# Altium schematic sheet CLKB_fabric_interface.SchDoc
size A3
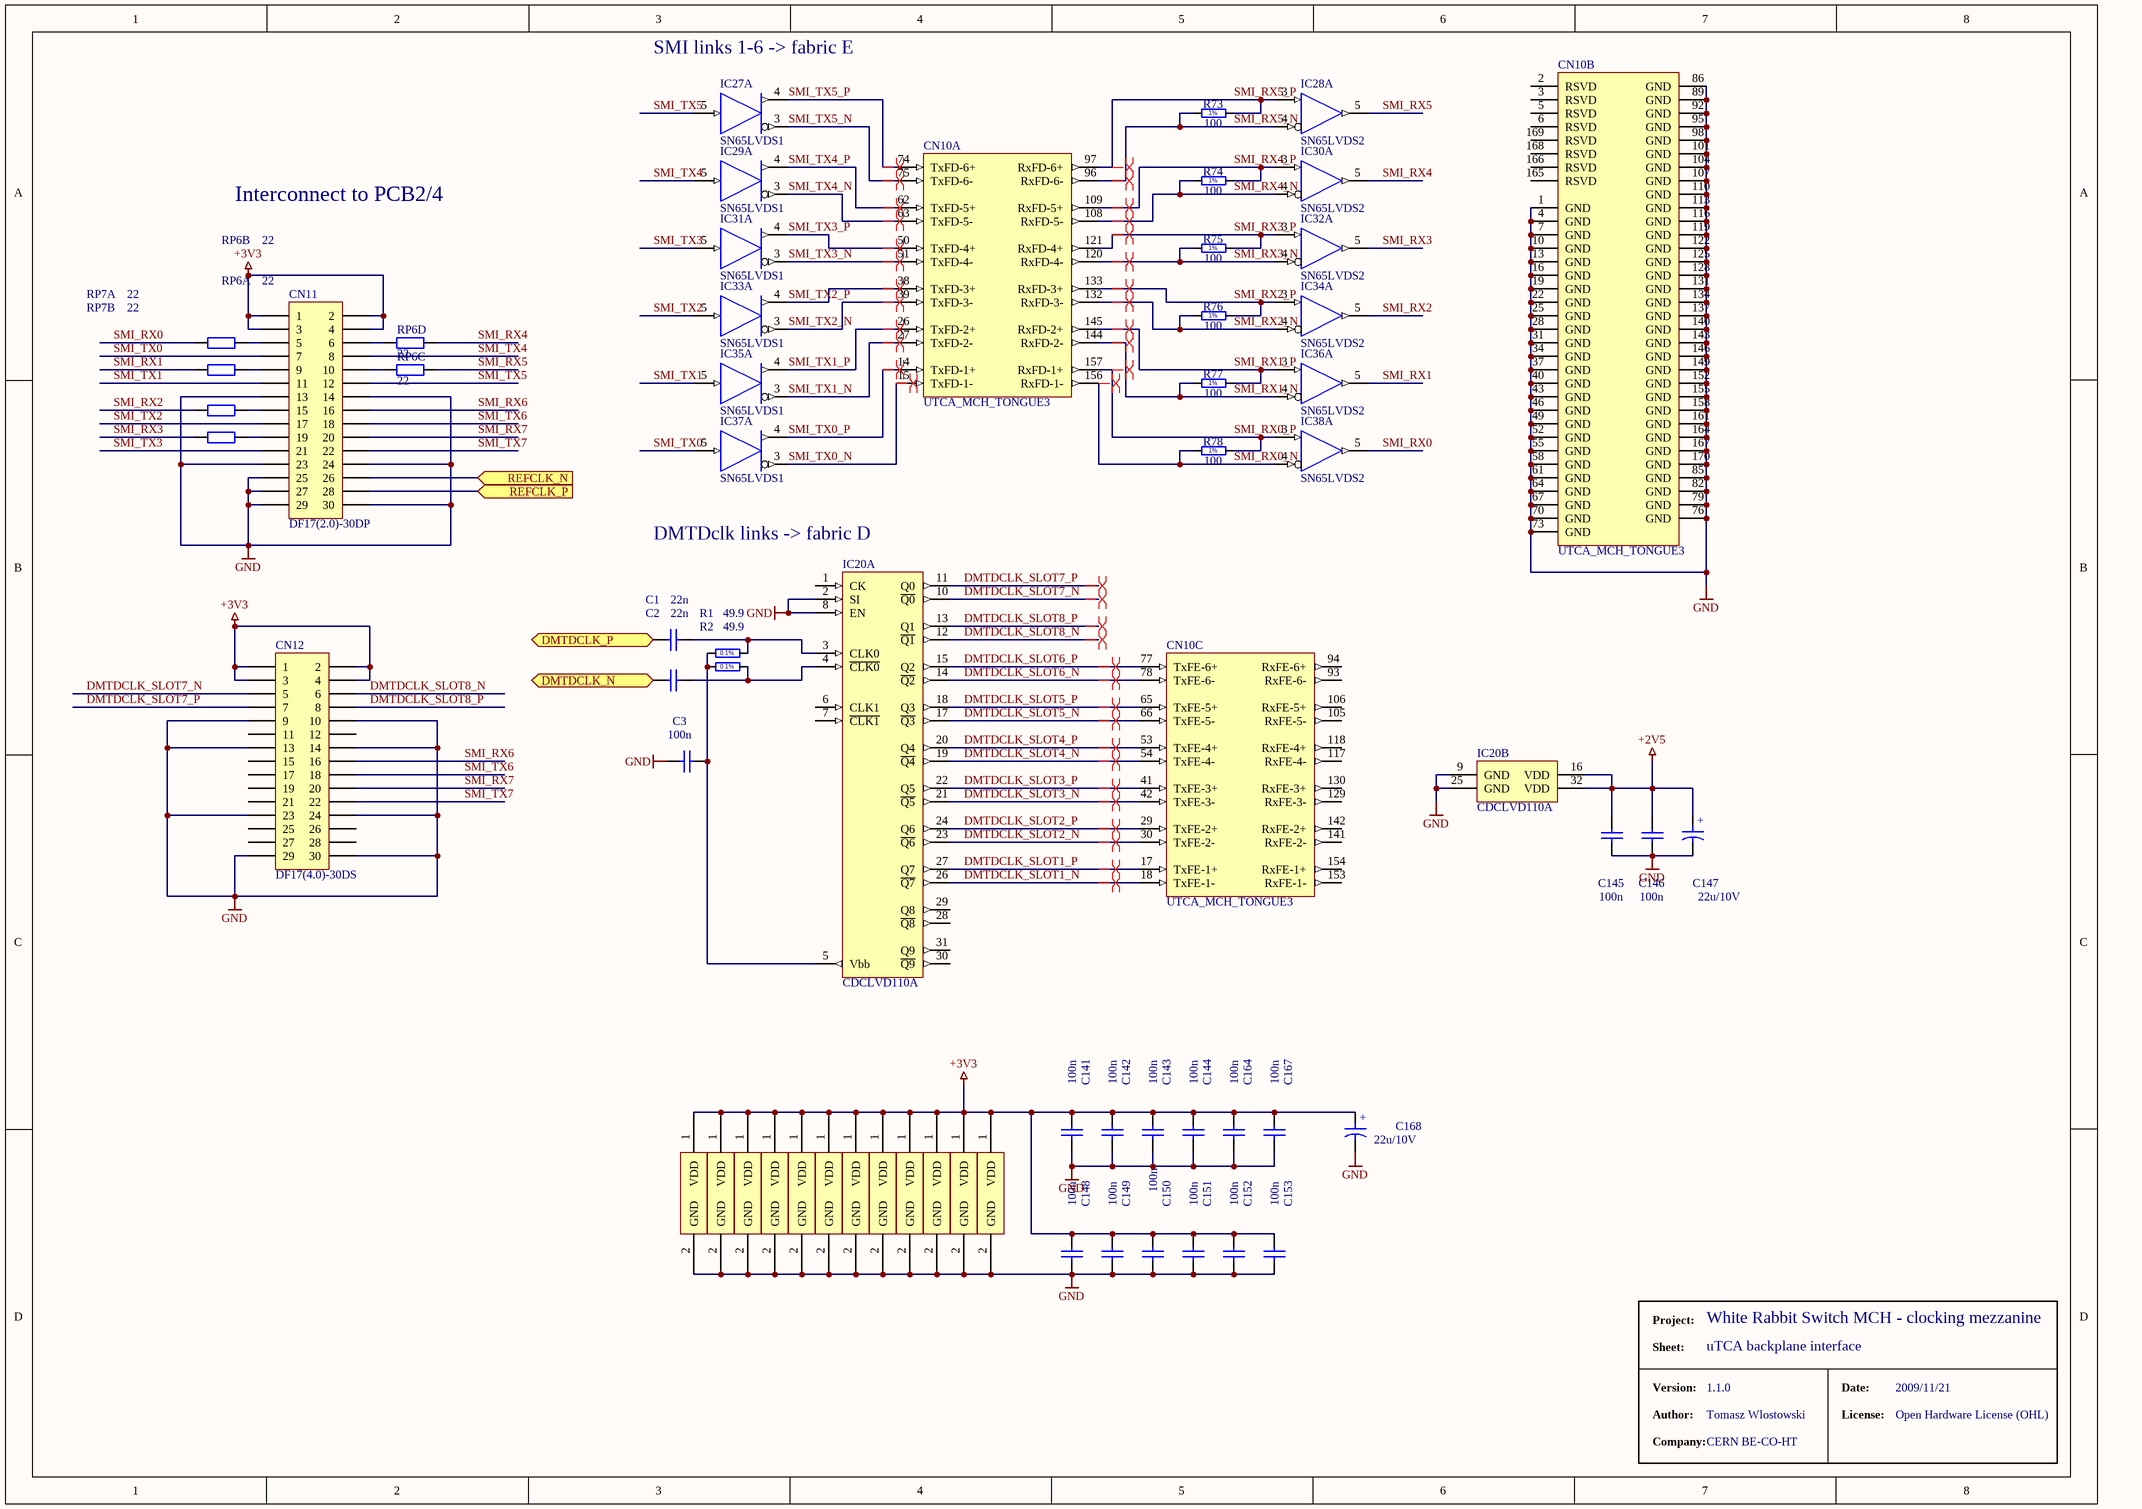
[diagram p0: CLKB_fabric_interface.SchDoc]

## Parts
C1  22n  [CAPC1005X55N]
C2  22n  [CAPC1005X55N]
C3  100n  [CAPC1608X87N]
C141  100n  [CAPC1608X87N]
C142  100n  [CAPC1608X87N]
C143  100n  [CAPC1608X87N]
C144  100n  [CAPC1608X87N]
C145  100n  [CAPC1608X87N]
C146  100n  [CAPC1608X87N]
C147  22u/10V  [CAPMP3216X180N]
C148  100n  [CAPC1608X87N]
C149  100n  [CAPC1608X87N]
C150  100n  [CAPC1608X87N]
C151  100n  [CAPC1608X87N]
C152  100n  [CAPC1608X87N]
C153  100n  [CAPC1608X87N]
C164  100n  [CAPC1608X87N]
C167  100n  [CAPC1608X87N]
C168  22u/10V  [CAPMP3216X180N]
CN10  UTCA_MCH_TONGUE3  [UTCA_MCH_TONGUE2_3_4]  (parts A,B,C of 7)
CN11  DF17(2.0)-30DP  [DF17-30-PLUG]
CN12  DF17(4.0)-30DS  [DF17-30-SOCKET]
IC20  CDCLVD110A  [QFP80P900X900-32M]  (parts A,B of 2)
IC27  SN65LVDS1  [SOT23-5AL]  (parts A,B of 2)
IC28  SN65LVDS2  [SOT23-5AL]  (parts A,B of 2)
IC29  SN65LVDS1  [SOT23-5AL]  (parts A,B of 2)
IC30  SN65LVDS2  [SOT23-5AL]  (parts A,B of 2)
IC31  SN65LVDS1  [SOT23-5AL]  (parts A,B of 2)
IC32  SN65LVDS2  [SOT23-5AL]  (parts A,B of 2)
IC33  SN65LVDS1  [SOT23-5AL]  (parts A,B of 2)
IC34  SN65LVDS2  [SOT23-5AL]  (parts A,B of 2)
IC35  SN65LVDS1  [SOT23-5AL]  (parts A,B of 2)
IC36  SN65LVDS2  [SOT23-5AL]  (parts A,B of 2)
IC37  SN65LVDS1  [SOT23-5AL]  (parts A,B of 2)
IC38  SN65LVDS2  [SOT23-5AL]  (parts A,B of 2)
R1  49.9  [RESC1608X55N]
R2  49.9  [RESC1608X55N]
R73  100  [RESC1608X55N]
R74  100  [RESC1608X55N]
R75  100  [RESC1608X55N]
R76  100  [RESC1608X55N]
R77  100  [RESC1608X55N]
R78  100  [RESC1608X55N]
RP6  value 22  [YC124]  (hidden comment: 22 0804)  (parts A,B,C,D of 4)
RP7  value 22  [YC124]  (hidden comment: 22 0804)  (parts A,B of 4)

## Ports
DMTDCLK_N (in), DMTDCLK_P (in), REFCLK_N (in), REFCLK_P (in)

## Nets
+2V5: C145.1 C146.1 C147.1 IC20.16(VDD) IC20.32(VDD)
+3V3: C141.1 C142.1 C143.1 C144.1 C148.1 C149.1 C150.1 C151.1 C152.1 C153.1 C164.1 C167.1 C168.1 CN11.1 CN11.2 CN11.3 CN11.4 CN12.1 CN12.2 CN12.3 CN12.4 IC27.1(VDD) IC28.1(VDD) IC29.1(VDD) IC30.1(VDD) IC31.1(VDD) IC32.1(VDD) IC33.1(VDD) IC34.1(VDD) IC35.1(VDD) IC36.1(VDD) IC37.1(VDD) IC38.1(VDD)
GND: C3.1 C141.2 C142.2 C143.2 C144.2 C145.2 C146.2 C147.2 C148.2 C149.2 C150.2 C151.2 C152.2 C153.2 C164.2 C167.2 C168.2 CN10.1(GND) CN10.4(GND) CN10.7(GND) CN10.10(GND) CN10.13(GND) CN10.16(GND) CN10.19(GND) CN10.22(GND) CN10.25(GND) CN10.28(GND) CN10.31(GND) CN10.34(GND) CN10.37(GND) CN10.40(GND) CN10.43(GND) CN10.46(GND) CN10.49(GND) CN10.52(GND) CN10.55(GND) CN10.58(GND) CN10.61(GND) CN10.64(GND) CN10.67(GND) CN10.70(GND) CN10.73(GND) CN10.76(GND) CN10.79(GND) CN10.82(GND) CN10.85(GND) CN10.86(GND) CN10.89(GND) CN10.92(GND) CN10.95(GND) CN10.98(GND) CN10.101(GND) CN10.104(GND) CN10.107(GND) CN10.110(GND) CN10.113(GND) CN10.116(GND) CN10.119(GND) CN10.122(GND) CN10.125(GND) CN10.128(GND) CN10.131(GND) CN10.134(GND) CN10.137(GND) CN10.140(GND) CN10.143(GND) CN10.146(GND) CN10.149(GND) CN10.152(GND) CN10.155(GND) CN10.158(GND) CN10.161(GND) CN10.164(GND) CN10.167(GND) CN10.170(GND) CN11.13 CN11.14 CN11.23 CN11.24 CN11.25 CN11.27 CN11.29 CN11.30 CN12.9 CN12.10 CN12.13 CN12.14 CN12.23 CN12.24 CN12.29 CN12.30 IC20.2(SI) IC20.8(EN) IC20.9(GND) IC20.25(GND) IC27.2(GND) IC28.2(GND) IC29.2(GND) IC30.2(GND) IC31.2(GND) IC32.2(GND) IC33.2(GND) IC34.2(GND) IC35.2(GND) IC36.2(GND) IC37.2(GND) IC38.2(GND)
DMTDCLK_N: C2.1 ; port DMTDCLK_N
DMTDCLK_P: C1.1 ; port DMTDCLK_P
DMTDCLK_SLOT1_N: CN10.18(TxFE-1-) IC20.26(~{Q7})
DMTDCLK_SLOT1_P: CN10.17(TxFE-1+) IC20.27(Q7)
DMTDCLK_SLOT2_N: CN10.30(TxFE-2-) IC20.23(~{Q6})
DMTDCLK_SLOT2_P: CN10.29(TxFE-2+) IC20.24(Q6)
DMTDCLK_SLOT3_N: CN10.42(TxFE-3-) IC20.21(~{Q5})
DMTDCLK_SLOT3_P: CN10.41(TxFE-3+) IC20.22(Q5)
DMTDCLK_SLOT4_N: CN10.54(TxFE-4-) IC20.19(~{Q4})
DMTDCLK_SLOT4_P: CN10.53(TxFE-4+) IC20.20(Q4)
DMTDCLK_SLOT5_N: CN10.66(TxFE-5-) IC20.17(~{Q3})
DMTDCLK_SLOT5_P: CN10.65(TxFE-5+) IC20.18(Q3)
DMTDCLK_SLOT6_N: CN10.78(TxFE-6-) IC20.14(~{Q2})
DMTDCLK_SLOT6_P: CN10.77(TxFE-6+) IC20.15(Q2)
DMTDCLK_SLOT7_N: CN12.5 IC20.10(~{Q0})
DMTDCLK_SLOT7_P: CN12.7 IC20.11(Q0)
DMTDCLK_SLOT8_N: CN12.6 IC20.12(~{Q1})
DMTDCLK_SLOT8_P: CN12.8 IC20.13(Q1)
REFCLK_N: CN11.26 ; port REFCLK_N
REFCLK_P: CN11.28 ; port REFCLK_P
SMI_RX0: IC38.5(Q) RP6.2(A)
SMI_RX0_N: CN10.156(RxFD-1-) IC38.4(/A) R78.1
SMI_RX0_P: CN10.157(RxFD-1+) IC38.3(A) R78.2
SMI_RX1: IC36.5(Q) RP6.1(A)
SMI_RX1_N: CN10.144(RxFD-2-) IC36.4(/A) R77.1
SMI_RX1_P: CN10.145(RxFD-2+) IC36.3(A) R77.2
SMI_RX2: IC34.5(Q) RP7.2(A)
SMI_RX2_N: CN10.132(RxFD-3-) IC34.4(/A) R76.1
SMI_RX2_P: CN10.133(RxFD-3+) IC34.3(A) R76.2
SMI_RX3: IC32.5(Q) RP7.1(A)
SMI_RX3_N: CN10.120(RxFD-4-) IC32.4(/A) R75.1
SMI_RX3_P: CN10.121(RxFD-4+) IC32.3(A) R75.2
SMI_RX4: IC30.5(Q) RP6.4(A)
SMI_RX4_N: CN10.108(RxFD-5-) IC30.4(/A) R74.1
SMI_RX4_P: CN10.109(RxFD-5+) IC30.3(A) R74.2
SMI_RX5: IC28.5(Q) RP6.3(A)
SMI_RX5_N: CN10.96(RxFD-6-) IC28.4(/A) R73.1
SMI_RX5_P: CN10.97(RxFD-6+) IC28.3(A) R73.2
SMI_RX6: CN11.16 CN12.16
SMI_RX7: CN11.20 CN12.20
SMI_TX0: CN11.7 IC37.5(A)
SMI_TX0_N: CN10.15(TxFD-1-) IC37.3(/Q)
SMI_TX0_P: CN10.14(TxFD-1+) IC37.4(Q)
SMI_TX1: CN11.11 IC35.5(A)
SMI_TX1_N: CN10.27(TxFD-2-) IC35.3(/Q)
SMI_TX1_P: CN10.26(TxFD-2+) IC35.4(Q)
SMI_TX2: CN11.17 IC33.5(A)
SMI_TX2_N: CN10.39(TxFD-3-) IC33.3(/Q)
SMI_TX2_P: CN10.38(TxFD-3+) IC33.4(Q)
SMI_TX3: CN11.21 IC31.5(A)
SMI_TX3_N: CN10.51(TxFD-4-) IC31.3(/Q)
SMI_TX3_P: CN10.50(TxFD-4+) IC31.4(Q)
SMI_TX4: CN11.8 IC29.5(A)
SMI_TX4_N: CN10.63(TxFD-5-) IC29.3(/Q)
SMI_TX4_P: CN10.62(TxFD-5+) IC29.4(Q)
SMI_TX5: CN11.12 IC27.5(A)
SMI_TX5_N: CN10.75(TxFD-6-) IC27.3(/Q)
SMI_TX5_P: CN10.74(TxFD-6+) IC27.4(Q)
SMI_TX6: CN11.18 CN12.18
SMI_TX7: CN11.22 CN12.22
NetC1_2: C1.2 IC20.3(CLK0) R1.2
NetC2_2: C2.2 IC20.4(~{CLK0}) R2.2
NetC3_2: C3.2 IC20.5(CLK0) R1.1 R2.1
NetCN11_5: CN11.5 RP6.7(B)
NetCN11_6: CN11.6 RP6.5(B)
NetCN11_9: CN11.9 RP6.8(B)
NetCN11_10: CN11.10 RP6.6(B)
NetCN11_15: CN11.15 RP7.7(B)
NetCN11_19: CN11.19 RP7.8(B)

Not connected (* = marked no-connect by the designer): CN10 2(RSVD) 3(RSVD) 5(RSVD) 6(RSVD) 93(RxFE-6-) 94(RxFE-6+) 105(RxFE-5-) 106(RxFE-5+) 117(RxFE-4-) 118(RxFE-4+) 129(RxFE-3-) 130(RxFE-3+) 141(RxFE-2-) 142(RxFE-2+) 153(RxFE-1-) 154(RxFE-1+) 165(RSVD) 166(RSVD) 168(RSVD) 169(RSVD); CN12 11 12 15 17 19 21 25 26 27 28; IC20 1(CK) 6(CLK1) 7(~{CLK1}) 28(~{Q8}) 29(Q8) 30(~{Q9}) 31(Q9)

## Layout directives
differential pair: DMTDCLK_SLOT1_N, DMTDCLK_SLOT1_P, DMTDCLK_SLOT2_N, DMTDCLK_SLOT2_P, DMTDCLK_SLOT3_N, DMTDCLK_SLOT3_P, DMTDCLK_SLOT4_N, DMTDCLK_SLOT4_P, DMTDCLK_SLOT5_N, DMTDCLK_SLOT5_P, DMTDCLK_SLOT6_N, DMTDCLK_SLOT6_P, DMTDCLK_SLOT7_N, DMTDCLK_SLOT7_P, DMTDCLK_SLOT8_N, DMTDCLK_SLOT8_P, SMI_RX0_N, SMI_RX0_P, SMI_RX1_N, SMI_RX1_P, SMI_RX2_N, SMI_RX2_P, SMI_RX3_N, SMI_RX3_P, SMI_RX4_N, SMI_RX4_P, SMI_RX5_N, SMI_RX5_P, SMI_TX0_N, SMI_TX0_P, SMI_TX1_N, SMI_TX1_P, SMI_TX2_N, SMI_TX2_P, SMI_TX3_N, SMI_TX3_P, SMI_TX4_N, SMI_TX4_P, SMI_TX5_N, SMI_TX5_P

## Notes on the sheet
- (near IC27) SMI links 1-6 -> fabric E
- Interconnect to PCB2/4
- DMTDclk links -> fabric D
- Project:
- White Rabbit Switch MCH - clocking mezzanine
- Sheet:
- Version:
- uTCA backplane interface
- 1.1.0
- Date:
- 2009/11/21
- Author:
- Company:
- Tomasz Wlostowski
- CERN BE-CO-HT
- License:
- Open Hardware License (OHL)
- (in symbol CTE3216-18_22UF_10V_10%) +
- (in symbol R0603_49R9_0.1%_0.063W_10PPM) 0.1%
- (in symbol R0603_100R_1%_0.1W_100PPM) 1%

## Library data of the parts
C1 C2 = CC0402_22NF_16V_10%_X7R: Non-polarised capacitor; Part Description: SMD Multilayer Chip Ceramic Capacitor; Manufacturer: GENERIC; Manufacturer1 Part Number: 223878715641; Manufacturer1 Datasheet: \\cern.ch\dfs\Applications\Altium\Datasheets\CC0402_X7R_PHYCOMP.pdf; Value: 22nF; Voltage: 16V; TC: X7R; Tolerance: ±10%; Table: Capacitors SMD; Part Number: CC0402_22NF_16V_10%_X7R; Component Kind: Standard; Component Type: Standard; Designator: Capacitor - non polarized; Library Reference: Capacitor - non polarized; Pin Count: 2; Status: Not Recommended; Manufacturer Part Number: CC0402_22NF_16V_10%_X7R; Case: 0402; Mounted: Yes; Socket: No; SMD: Yes; Manufacturer1 Example: PHYCOMP; Manufacturer1 ComponentHeight: 0.55mm; HelpURL: \\cern.ch\dfs\Applications\Altium\Datasheets\CC0402_X7R_PHYCOMP.pdf; Author: CERN DEM JLC; CreateDate: 2007-12-03; LatestRevisionDate: 2007-12-03
C3 C141-C146 C148-C153 C164 C167 = CC0603_100NF_50V_10%_X7R: Non-polarised capacitor; Part Description: SMD Multilayer Chip Ceramic Capacitor; Manufacturer: GENERIC; Manufacturer1 Part Number: 223858615649; Manufacturer1 Datasheet: \\cern.ch\dfs\Applications\Altium\Datasheets\CC0603_X7R_PHYCOMP.pdf; Value: 100nF; Voltage: 50V; TC: X7R; Tolerance: ±10%; Table: Capacitors SMD; Part Number: CC0603_100NF_50V_10%_X7R; Component Kind: Standard; Component Type: Standard; Designator: Capacitor - non polarized; Library Reference: Capacitor - non polarized; Pin Count: 2; Status: Preferred; Manufacturer Part Number: CC0603_100NF_50V_10%_X7R; Case: 0603; Mounted: Yes; Socket: No; SMD: Yes; Manufacturer1 Example: PHYCOMP; Manufacturer1 ComponentHeight: 0.87mm; HelpURL: \\cern.ch\dfs\Applications\Altium\Datasheets\CC0603_X7R_PHYCOMP.pdf; Author: CERN DEM JLC
  C3: CreateDate: 2007-12-03; LatestRevisionDate: 2007-12-03
  C141-C146 C148-C153 C164 C167: CreateDate: 12/3/2007; LatestRevisionDate: 12/3/2007
C147 C168 = CTE3216-18_22UF_10V_10%: Polarised capacitor; Part Description: Solid Tantalum Chip Capacitor; Manufacturer: GENERIC; Manufacturer1 Part Number: TAJA226K010R; Manufacturer1 Datasheet: \\cern.ch\dfs\Applications\Altium\Datasheets\CTE_AVX_TAJ.pdf; Value: 22uF; Voltage: 10V; Tolerance: ±10%; Table: Capacitors SMD; Part Number: CTE3216-18_22UF_10V_10%; Component Kind: Standard; Component Type: Standard; Designator: Capacitor - polarized; Library Reference: Capacitor - polarized; Pin Count: 2; Status: Preferred; Manufacturer Part Number: CTE3216-18_22UF_10V_10%; Case: A; Mounted: Yes; Socket: No; SMD: Yes; Manufacturer1 Example: AVX; Manufacturer1 ComponentHeight: 1.8mm; HelpURL: \\cern.ch\dfs\Applications\Altium\Datasheets\CTE_AVX_TAJ.pdf; Author: CERN DEM JLC; CreateDate: 12/3/2007; LatestRevisionDate: 12/3/2007
CN10 = UTCA_MCH_TONGUE3: microTCA MTCA.0 standard MCH connector 3
CN11 = KX14_30p: multipin B2B connector (plug); Supplier: Mouser
CN12 = KX15_30p: multipin B2B connector (plug); Supplier: Mouser
IC20 = CDCLVD110A: TI LVDS 1:10 fanout
IC27 IC29 IC31 IC33 IC35 IC37 = SN65LVDS1: TTL->LVDS buffer; RefId: 8452482; Value: SN65LVDS1DBVT; Supplier: Farnell
IC28 IC30 IC32 IC34 IC36 IC38 = SN65LVDS2: LVDS->TTL buffer; RefId: 1652269; Value: SN65LVDS2DBVR; Supplier: Farnell
R1 R2 = R0603_49R9_0.1%_0.063W_10PPM: Resistor - 0.1%; Part Description: Thin Film Chip Resistor; Manufacturer: GENERIC; Manufacturer1 Part Number: RN73C1J49R9BTDF; Manufacturer1 Datasheet: \\cern.ch\dfs\Applications\Altium\Datasheets\R0603_Tyco_RN73.pdf; Value: 49R9; Power: 0.063W; TC: ±10ppm; Table: Resistors SMD; Part Number: R0603_49R9_0.1%_0.063W_10PPM; Component Kind: Standard; Component Type: Standard; Designator: Resistor - 0.1%; Library Reference: Resistor - 0.1%; Pin Count: 2; Status: Not recommended; Tolerance: ±0.1%; Manufacturer Part Number: R0603_49R9_0.1%_0.063W_10PPM; Case: 0603; Mounted: Yes; Socket: No; SMD: Yes; Manufacturer1 Example: TYCO HOLSWORTHY; Manufacturer1 ComponentHeight: 0.5mm; HelpURL: \\cern.ch\dfs\Applications\Altium\Datasheets\R0603_Tyco_RN73.pdf; Author: CERN DEM JLC; CreateDate: 2007-12-03; LatestRevisionDate: 2008-03-13
R73-R78 = R0603_100R_1%_0.1W_100PPM: Resistor - 1%; Part Description: General Purpose Thick Film Chip Resistor; Manufacturer: GENERIC; Manufacturer1 Part Number: NRC06F4700TRF; Manufacturer1 Datasheet: \\cern.ch\dfs\Applications\Altium\Datasheets\R0603_NIC_NRC.pdf; Power: 0.1W; TC: ±100ppm/°C; Table: Resistors SMD; Part Number: R0603_100R_1%_0.1W_100PPM; Component Kind: Standard; Component Type: Standard; Designator: Resistor - 1%; Library Reference: Resistor - 1%; Pin Count: 2; Value: 100; Status: Preferred; Tolerance: ±1%; Manufacturer Part Number: R0603_100R_1%_0.1W_100PPM; Case: 0603; Mounted: Yes; Socket: No; SMD: Yes; Manufacturer1 Example: NIC COMPONENT; Manufacturer1 ComponentHeight: 0.55mm; HelpURL: \\cern.ch\dfs\Applications\Altium\Datasheets\R0603_NIC_NRC.pdf; Author: CERN DEM JLC; CreateDate: 12/3/2007; LatestRevisionDate: 3/13/2008
RP6 RP7 = Res_Pack4_22R_YC124: 4-resistor pack; RefId: AVX  CRB2A4 series; Supplier: Farnell